# Altium schematic sheet BlockDiagram.SchDoc
size A4; SheetNumber: 1; SheetTotal: 4
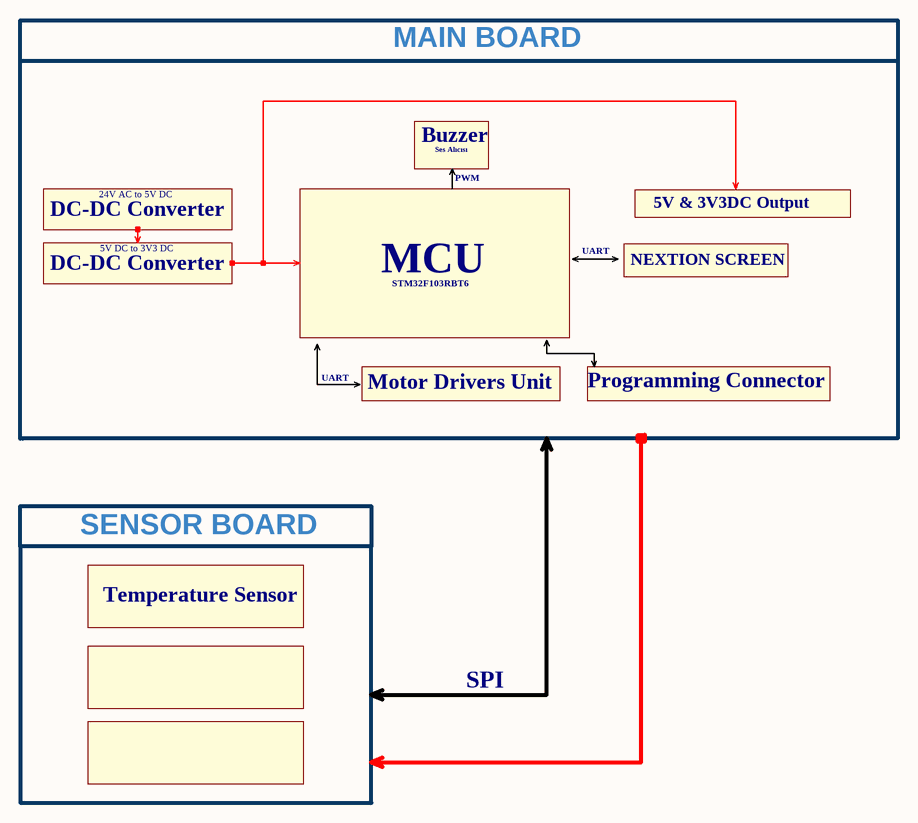
[diagram p0: BlockDiagram.SchDoc]

## Notes on the sheet
- MAIN BOARD
- 24V AC to 5V DC
- Buzzer
- Ses Alıcısı
- PWM
- DC-DC Converter
- 5V DC to 3V3 DC
- UART
- NEXTION SCREEN
- 5V & 3V3DC Output
- MCU
- STM32F103RBT6
- Motor Drivers Unit
- Programming Connector
- SENSOR BOARD
- Temperature Sensor
- SPI